# Altium project SOM Board with RK3399.PrjPcb
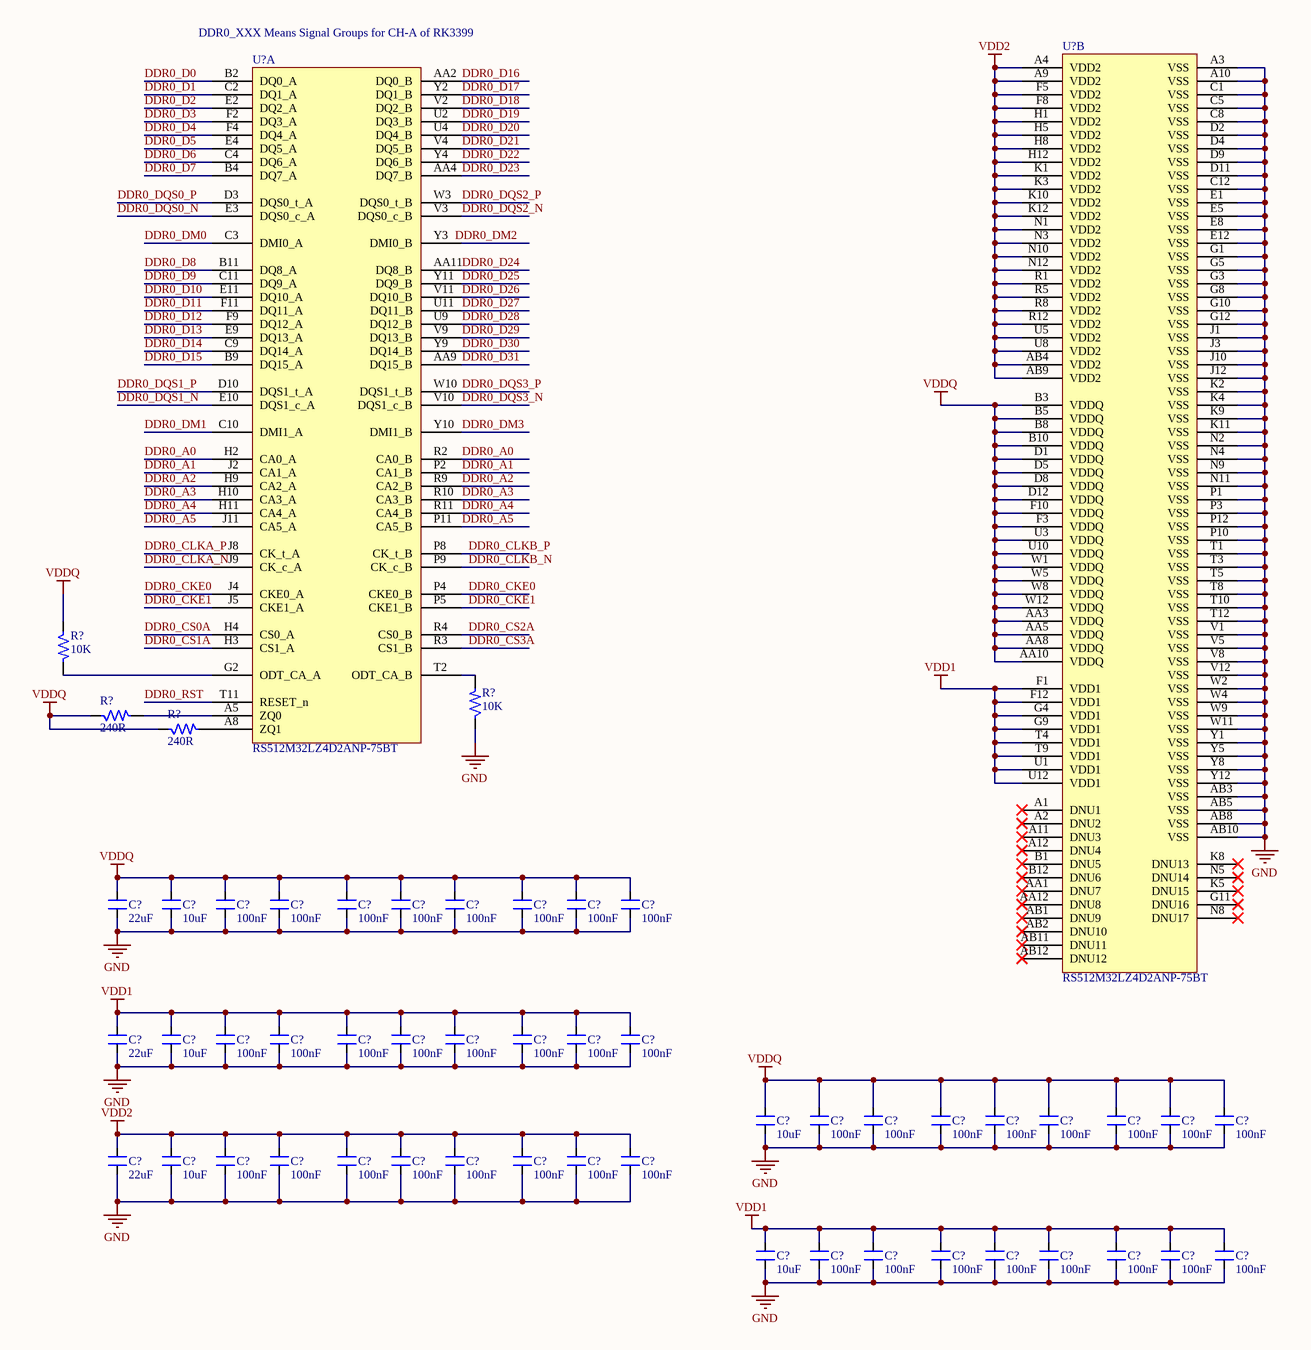
[diagram p0: Sheet1.SchDoc]
3 sheets, 122 parts. Net scope: global (net labels, ports and power ports of the same name join across sheets).
Sheets:
  Sheet1.SchDoc
  Sheet2.SchDoc
  Sheet3.SchDoc

## Sheet Sheet1.SchDoc
size A3

### Parts
(Parts that share a designator on the sheet are numbered #1, #2 ... from top to bottom, then left to right.)
C?#1  22uF  [CAP_0603]
C?#2  10uF  [CAP_0603]
C?#3  100nF  [CAP_0201]
C?#4  100nF  [CAP_0201]
C?#5  100nF  [CAP_0201]
C?#6  100nF  [CAP_0201]
C?#7  100nF  [CAP_0201]
C?#8  100nF  [CAP_0201]
C?#9  100nF  [CAP_0201]
C?#10  100nF  [CAP_0201]
C?#11  22uF  [CAP_0603]
C?#12  10uF  [CAP_0603]
C?#13  100nF  [CAP_0201]
C?#14  100nF  [CAP_0201]
C?#15  100nF  [CAP_0201]
C?#16  100nF  [CAP_0201]
C?#17  100nF  [CAP_0201]
C?#18  100nF  [CAP_0201]
C?#19  100nF  [CAP_0201]
C?#20  100nF  [CAP_0201]
C?#21  10uF  [CAP_0603]
C?#22  100nF  [CAP_0201]
C?#23  100nF  [CAP_0201]
C?#24  100nF  [CAP_0201]
C?#25  100nF  [CAP_0201]
C?#26  100nF  [CAP_0201]
C?#27  100nF  [CAP_0201]
C?#28  100nF  [CAP_0201]
C?#29  100nF  [CAP_0201]
C?#30  22uF  [CAP_0603]
C?#31  10uF  [CAP_0603]
C?#32  100nF  [CAP_0201]
C?#33  100nF  [CAP_0201]
C?#34  100nF  [CAP_0201]
C?#35  100nF  [CAP_0201]
C?#36  100nF  [CAP_0201]
C?#37  100nF  [CAP_0201]
C?#38  100nF  [CAP_0201]
C?#39  100nF  [CAP_0201]
C?#40  10uF  [CAP_0603]
C?#41  100nF  [CAP_0201]
C?#42  100nF  [CAP_0201]
C?#43  100nF  [CAP_0201]
C?#44  100nF  [CAP_0201]
C?#45  100nF  [CAP_0201]
C?#46  100nF  [CAP_0201]
C?#47  100nF  [CAP_0201]
C?#48  100nF  [CAP_0201]
R?#1  10K  [RES_0201]
R?#2  240R  [RES_0201]
R?#3  240R  [RES_0201]
R?#4  10K  [RES_0201]
U?#1  RS512M32LZ4D2ANP-75BT  [FBGA200_SMD]  (part B of 2)
U?#2  RS512M32LZ4D2ANP-75BT  [FBGA200_SMD]  (part A of 2)

### Nets
GND: C?#1.1 C?#2.1 C?#3.1 C?#4.1 C?#5.1 C?#6.1 C?#7.1 C?#8.1 C?#9.1 C?#10.1 C?#11.1 C?#12.1 C?#13.1 C?#14.1 C?#15.1 C?#16.1 C?#17.1 C?#18.1 C?#19.1 C?#20.1 C?#21.1 C?#22.1 C?#23.1 C?#24.1 C?#25.1 C?#26.1 C?#27.1 C?#28.1 C?#29.1 C?#30.1 C?#31.1 C?#32.1 C?#33.1 C?#34.1 C?#35.1 C?#36.1 C?#37.1 C?#38.1 C?#39.1 C?#40.1 C?#41.1 C?#42.1 C?#43.1 C?#44.1 C?#45.1 C?#46.1 C?#47.1 C?#48.1 R?#4.1 U?#1.A3(VSS) U?#1.A10(VSS) U?#1.AB3(VSS) U?#1.AB5(VSS) U?#1.AB8(VSS) U?#1.AB10(VSS) U?#1.C1(VSS) U?#1.C5(VSS) U?#1.C8(VSS) U?#1.C12(VSS) U?#1.D2(VSS) U?#1.D4(VSS) U?#1.D9(VSS) U?#1.D11(VSS) U?#1.E1(VSS) U?#1.E5(VSS) U?#1.E8(VSS) U?#1.E12(VSS) U?#1.G1(VSS) U?#1.G3(VSS) U?#1.G5(VSS) U?#1.G8(VSS) U?#1.G10(VSS) U?#1.G12(VSS) U?#1.J1(VSS) U?#1.J3(VSS) U?#1.J10(VSS) U?#1.J12(VSS) U?#1.K2(VSS) U?#1.K4(VSS) U?#1.K9(VSS) U?#1.K11(VSS) U?#1.N2(VSS) U?#1.N4(VSS) U?#1.N9(VSS) U?#1.N11(VSS) U?#1.P1(VSS) U?#1.P3(VSS) U?#1.P10(VSS) U?#1.P12(VSS) U?#1.T1(VSS) U?#1.T3(VSS) U?#1.T5(VSS) U?#1.T8(VSS) U?#1.T10(VSS) U?#1.T12(VSS) U?#1.V1(VSS) U?#1.V5(VSS) U?#1.V8(VSS) U?#1.V12(VSS) U?#1.W2(VSS) U?#1.W4(VSS) U?#1.W9(VSS) U?#1.W11(VSS) U?#1.Y1(VSS) U?#1.Y5(VSS) U?#1.Y8(VSS) U?#1.Y12(VSS)
VDD1: C?#11.2 C?#12.2 C?#13.2 C?#14.2 C?#15.2 C?#16.2 C?#17.2 C?#18.2 C?#19.2 C?#20.2 C?#40.2 C?#41.2 C?#42.2 C?#43.2 C?#44.2 C?#45.2 C?#46.2 C?#47.2 C?#48.2 U?#1.F1(VDD1) U?#1.F12(VDD1) U?#1.G4(VDD1) U?#1.G9(VDD1) U?#1.T4(VDD1) U?#1.T9(VDD1) U?#1.U1(VDD1) U?#1.U12(VDD1)
VDD2: C?#30.2 C?#31.2 C?#32.2 C?#33.2 C?#34.2 C?#35.2 C?#36.2 C?#37.2 C?#38.2 C?#39.2 U?#1.A4(VDD2) U?#1.A9(VDD2) U?#1.AB4(VDD2) U?#1.AB9(VDD2) U?#1.F5(VDD2) U?#1.F8(VDD2) U?#1.H1(VDD2) U?#1.H5(VDD2) U?#1.H8(VDD2) U?#1.H12(VDD2) U?#1.K1(VDD2) U?#1.K3(VDD2) U?#1.K10(VDD2) U?#1.K12(VDD2) U?#1.N1(VDD2) U?#1.N3(VDD2) U?#1.N10(VDD2) U?#1.N12(VDD2) U?#1.R1(VDD2) U?#1.R5(VDD2) U?#1.R8(VDD2) U?#1.R12(VDD2) U?#1.U5(VDD2) U?#1.U8(VDD2)
VDDQ: C?#1.2 C?#2.2 C?#3.2 C?#4.2 C?#5.2 C?#6.2 C?#7.2 C?#8.2 C?#9.2 C?#10.2 C?#21.2 C?#22.2 C?#23.2 C?#24.2 C?#25.2 C?#26.2 C?#27.2 C?#28.2 C?#29.2 R?#1.1 R?#2.1 R?#3.1 U?#1.AA3(VDDQ) U?#1.AA5(VDDQ) U?#1.AA8(VDDQ) U?#1.AA10(VDDQ) U?#1.B3(VDDQ) U?#1.B5(VDDQ) U?#1.B8(VDDQ) U?#1.B10(VDDQ) U?#1.D1(VDDQ) U?#1.D5(VDDQ) U?#1.D8(VDDQ) U?#1.D12(VDDQ) U?#1.F3(VDDQ) U?#1.F10(VDDQ) U?#1.U3(VDDQ) U?#1.U10(VDDQ) U?#1.W1(VDDQ) U?#1.W5(VDDQ) U?#1.W8(VDDQ) U?#1.W12(VDDQ)
DDR0_A0: U?#2.H2(CA0_A) U?#2.R2(CA0_B)
DDR0_A1: U?#2.J2(CA1_A) U?#2.P2(CA1_B)
DDR0_A2: U?#2.H9(CA2_A) U?#2.R9(CA2_B)
DDR0_A3: U?#2.H10(CA3_A) U?#2.R10(CA3_B)
DDR0_A4: U?#2.H11(CA4_A) U?#2.R11(CA4_B)
DDR0_A5: U?#2.J11(CA5_A) U?#2.P11(CA5_B)
DDR0_CKE0: U?#2.J4(CKE0_A) U?#2.P4(CKE0_B)
DDR0_CKE1: U?#2.J5(CKE1_A) U?#2.P5(CKE1_B)
DDR0_CLKA_N: U?#2.J9(CK_c_A)
DDR0_CLKA_P: U?#2.J8(CK_t_A)
DDR0_CLKB_N: U?#2.P9(CK_c_B)
DDR0_CLKB_P: U?#2.P8(CK_t_B)
DDR0_CS0A: U?#2.H4(CS0_A)
DDR0_CS1A: U?#2.H3(CS1_A)
DDR0_CS2A: U?#2.R4(CS0_B)
DDR0_CS3A: U?#2.R3(CS1_B)
DDR0_D0: U?#2.B2(DQ0_A)
DDR0_D1: U?#2.C2(DQ1_A)
DDR0_D2: U?#2.E2(DQ2_A)
DDR0_D3: U?#2.F2(DQ3_A)
DDR0_D4: U?#2.F4(DQ4_A)
DDR0_D5: U?#2.E4(DQ5_A)
DDR0_D6: U?#2.C4(DQ6_A)
DDR0_D7: U?#2.B4(DQ7_A)
DDR0_D8: U?#2.B11(DQ8_A)
DDR0_D9: U?#2.C11(DQ9_A)
DDR0_D10: U?#2.E11(DQ10_A)
DDR0_D11: U?#2.F11(DQ11_A)
DDR0_D12: U?#2.F9(DQ12_A)
DDR0_D13: U?#2.E9(DQ13_A)
DDR0_D14: U?#2.C9(DQ14_A)
DDR0_D15: U?#2.B9(DQ15_A)
DDR0_D16: U?#2.AA2(DQ0_B)
DDR0_D17: U?#2.Y2(DQ1_B)
DDR0_D18: U?#2.V2(DQ2_B)
DDR0_D19: U?#2.U2(DQ3_B)
DDR0_D20: U?#2.U4(DQ4_B)
DDR0_D21: U?#2.V4(DQ5_B)
DDR0_D22: U?#2.Y4(DQ6_B)
DDR0_D23: U?#2.AA4(DQ7_B)
DDR0_D24: U?#2.AA11(DQ8_B)
DDR0_D25: U?#2.Y11(DQ9_B)
DDR0_D26: U?#2.V11(DQ10_B)
DDR0_D27: U?#2.U11(DQ11_B)
DDR0_D28: U?#2.U9(DQ12_B)
DDR0_D29: U?#2.V9(DQ13_B)
DDR0_D30: U?#2.Y9(DQ14_B)
DDR0_D31: U?#2.AA9(DQ15_B)
DDR0_DM0: U?#2.C3(DMI0_A)
DDR0_DM1: U?#2.C10(DMI1_A)
DDR0_DM3: U?#2.Y10(DMI1_B)
DDR0_DQS0_N: U?#2.E3(DQS0_c_A)
DDR0_DQS0_P: U?#2.D3(DQS0_t_A)
DDR0_DQS1_N: U?#2.E10(DQS1_c_A)
DDR0_DQS1_P: U?#2.D10(DQS1_t_A)
DDR0_DQS2_N: U?#2.V3(DQS0_c_B)
DDR0_DQS2_P: U?#2.W3(DQS0_t_B)
DDR0_DQS3_N: U?#2.V10(DQS1_c_B)
DDR0_DQS3_P: U?#2.W10(DQS1_t_B)
DDR0_RST: U?#2.T11(RESET_n)
NetR?#1_2: R?#1.2 U?#2.G2(ODT_CA_A)
NetR?#2_2: R?#2.2 U?#2.A5(ZQ0)
NetR?#3_2: R?#3.2 U?#2.A8(ZQ1)
NetR?#4_2: R?#4.2 U?#2.T2(ODT_CA_B)

Not connected (* = marked no-connect by the designer): U?#1 A1(DNU1)* A2(DNU2)* A11(DNU3)* A12(DNU4)* AA1(DNU7)* AA12(DNU8)* AB1(DNU9)* AB2(DNU10)* AB11(DNU11)* AB12(DNU12)* B1(DNU5)* B12(DNU6)* G11(DNU16)* K5(DNU15)* K8(DNU13)* N5(DNU14)* N8(DNU17)*; U?#2 Y3(DMI0_B)

### Notes on the sheet
- (near U?#2) DDR0_XXX Means Signal Groups for CH-A of RK3399
- Labels drawn without touching a wire or pin: DDR0_DM2
- Title
- Size:
- Date:
- A3
- Number:
- Time:
- Revision:
- Sheet
- of
- File:

### Library data of the parts
C?#1 C?#11 C?#30 = CAP_22uF-10V-20%-0603: 22µF ±20% 10V Ceramic Capacitor X5R 0603 (1608 Metric) /; Manufacturer: Murata Electronics; Manufacturer Part Number: GRM188R61A226ME15D; Case/Package: 0603; Supplier-1: Digikey
C?#2 C?#12 C?#21 C?#31 C?#40 = CAP_10uF-10V-10%-0603: 10µF ±10% 10V Ceramic Capacitor X5R 0603 (1608 Metric) /; Manufacturer Part Number: GRM188R61A106KE69J; Manufacturer: Murata Electronics; Case/Package: 0603; Supplier-1: Digikey
C?#3-C?#10 C?#13-C?#20 C?#22-C?#29 C?#32-C?#39 C?#41-C?#48 = CAP_100nF-25V-10%-0201: 0.1µF ±10% 25V Ceramic Capacitor X5R 0201 (0603 Metric) /; Manufacturer: TDK Corporation; Manufacturer Part Number: C0603X5R1E104K030BB; Case/Package: 0201; Supplier-1: Digikey
R?#1 R?#4 = RES_10K-0.05W-1%-0201: 10 kOhms ±1% 0.05W, 1/20W Chip Resistor 0201 (0603 Metric) Thick Film /; Manufacturer: Stackpole Electronics Inc; Manufacturer Part Number: RMCF0201FT10K0; Case/Package: 0201; Supplier-1: Digikey
R?#2 R?#3 = RES_240R-0.05W-1%-0201: 240 Ohms ±1% 0.05W, 1/20W Chip Resistor 0201 (0603 Metric) Thick Film /; Manufacturer: Yageo; Manufacturer Part Number: RC0201FR-07240RL; Case/Package: 0201; Supplier-1: Digikey
U?#1 U?#2 = IC_RS512M32LZ4D2ANP-75BT: LPDDR4/4X Package FBGA 200b Density 4Gbit~64Gbit Operating Temperature Range：-25~85℃ Speed：2667Mbps/3200Mbps/3733Mbps Voltage：VDD1/VDD2/VDDQ= 1.8 / 1.1 / 1.1 V（LPDDR4）VDD1/VDD2/VDDQ = 1.8 / 1.1 / 0.6 V（LPDDR4X）Approved Verification Platform：MTK、Spreadtrum; Manufacturer: RAYSON; Manufacturer Part Number: RS512M32LZ4D2ANP-75BT; Case/Package: FBGA 200b; Supplier-1: RAYSON

## Sheet Sheet2.SchDoc
size A3; Organization: Altium Limited; Address1: L3, 12a Rodborough Rd; Address2: Frenchs Forest; Address3: NSW; Address4: Australia 2086
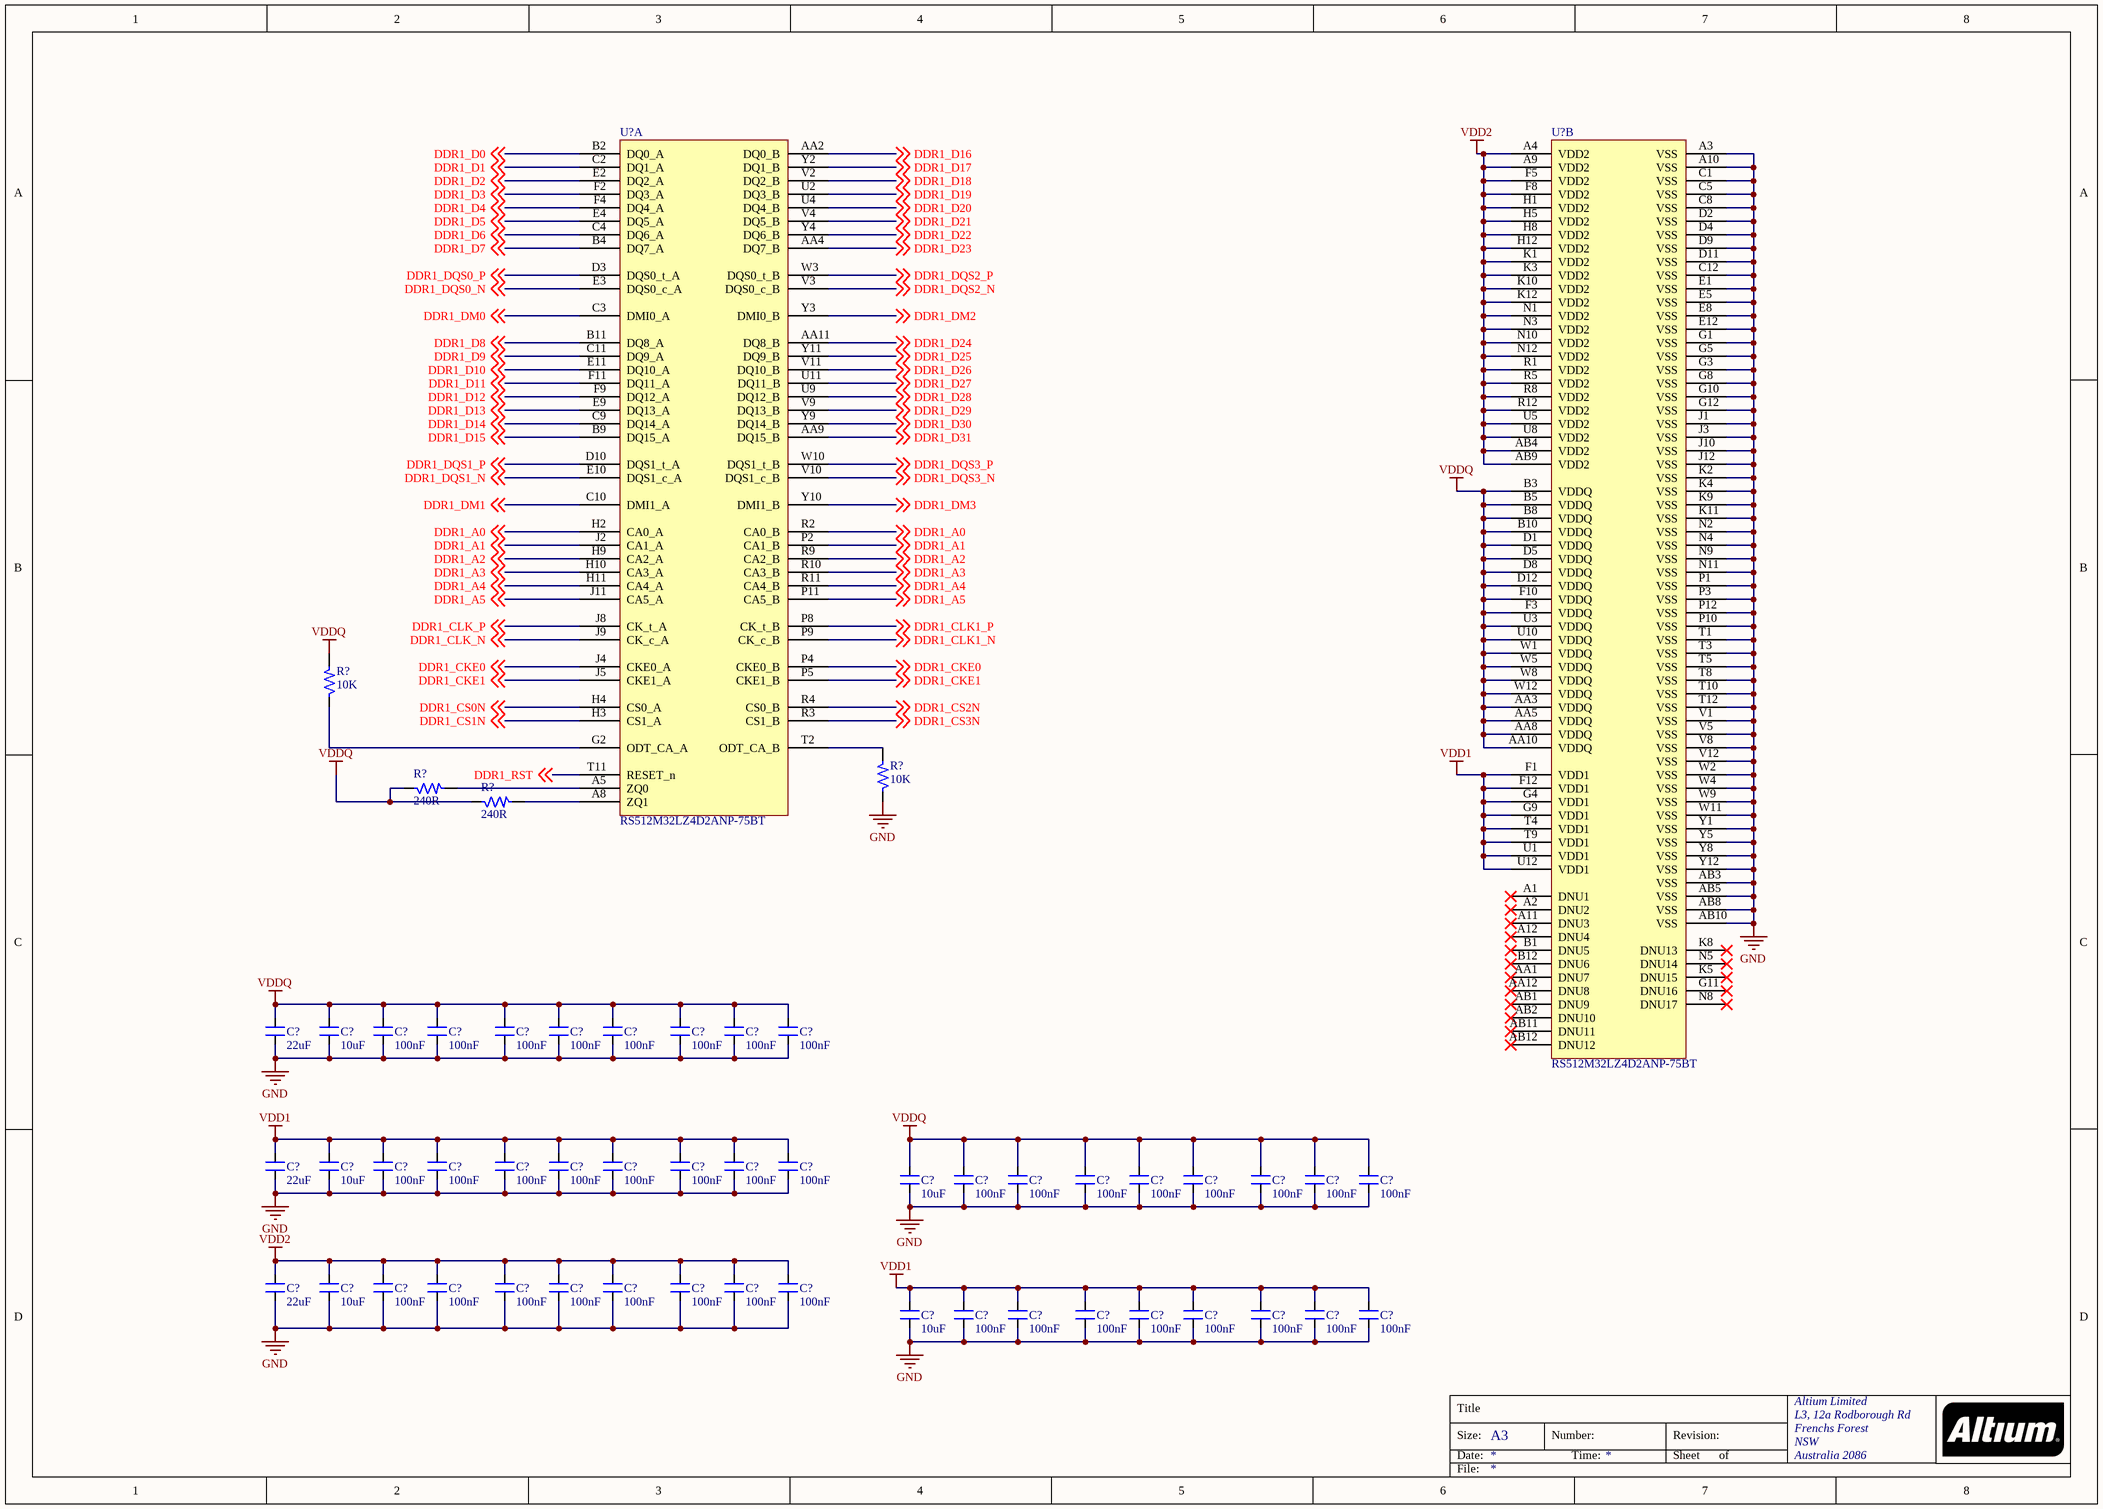
[diagram p1: Sheet2.SchDoc]

### Parts
(Parts that share a designator on the sheet are numbered #1, #2 ... from top to bottom, then left to right.)
C?#49  22uF  [CAP_0603]
C?#50  10uF  [CAP_0603]
C?#51  100nF  [CAP_0201]
C?#52  100nF  [CAP_0201]
C?#53  100nF  [CAP_0201]
C?#54  100nF  [CAP_0201]
C?#55  100nF  [CAP_0201]
C?#56  100nF  [CAP_0201]
C?#57  100nF  [CAP_0201]
C?#58  100nF  [CAP_0201]
C?#59  22uF  [CAP_0603]
C?#60  10uF  [CAP_0603]
C?#61  100nF  [CAP_0201]
C?#62  100nF  [CAP_0201]
C?#63  100nF  [CAP_0201]
C?#64  100nF  [CAP_0201]
C?#65  100nF  [CAP_0201]
C?#66  100nF  [CAP_0201]
C?#67  100nF  [CAP_0201]
C?#68  100nF  [CAP_0201]
C?#69  10uF  [CAP_0603]
C?#70  100nF  [CAP_0201]
C?#71  100nF  [CAP_0201]
C?#72  100nF  [CAP_0201]
C?#73  100nF  [CAP_0201]
C?#74  100nF  [CAP_0201]
C?#75  100nF  [CAP_0201]
C?#76  100nF  [CAP_0201]
C?#77  100nF  [CAP_0201]
C?#78  22uF  [CAP_0603]
C?#79  10uF  [CAP_0603]
C?#80  100nF  [CAP_0201]
C?#81  100nF  [CAP_0201]
C?#82  100nF  [CAP_0201]
C?#83  100nF  [CAP_0201]
C?#84  100nF  [CAP_0201]
C?#85  100nF  [CAP_0201]
C?#86  100nF  [CAP_0201]
C?#87  100nF  [CAP_0201]
C?#88  10uF  [CAP_0603]
C?#89  100nF  [CAP_0201]
C?#90  100nF  [CAP_0201]
C?#91  100nF  [CAP_0201]
C?#92  100nF  [CAP_0201]
C?#93  100nF  [CAP_0201]
C?#94  100nF  [CAP_0201]
C?#95  100nF  [CAP_0201]
C?#96  100nF  [CAP_0201]
R?#5  10K  [RES_0201]
R?#6  240R  [RES_0201]
R?#7  240R  [RES_0201]
R?#8  10K  [RES_0201]
U?#3  RS512M32LZ4D2ANP-75BT  [FBGA200_SMD]  (part A of 2)
U?#4  RS512M32LZ4D2ANP-75BT  [FBGA200_SMD]  (part B of 2)

### Nets
GND: C?#49.1 C?#50.1 C?#51.1 C?#52.1 C?#53.1 C?#54.1 C?#55.1 C?#56.1 C?#57.1 C?#58.1 C?#59.1 C?#60.1 C?#61.1 C?#62.1 C?#63.1 C?#64.1 C?#65.1 C?#66.1 C?#67.1 C?#68.1 C?#69.1 C?#70.1 C?#71.1 C?#72.1 C?#73.1 C?#74.1 C?#75.1 C?#76.1 C?#77.1 C?#78.1 C?#79.1 C?#80.1 C?#81.1 C?#82.1 C?#83.1 C?#84.1 C?#85.1 C?#86.1 C?#87.1 C?#88.1 C?#89.1 C?#90.1 C?#91.1 C?#92.1 C?#93.1 C?#94.1 C?#95.1 C?#96.1 R?#8.1 U?#4.A3(VSS) U?#4.A10(VSS) U?#4.AB3(VSS) U?#4.AB5(VSS) U?#4.AB8(VSS) U?#4.AB10(VSS) U?#4.C1(VSS) U?#4.C5(VSS) U?#4.C8(VSS) U?#4.C12(VSS) U?#4.D2(VSS) U?#4.D4(VSS) U?#4.D9(VSS) U?#4.D11(VSS) U?#4.E1(VSS) U?#4.E5(VSS) U?#4.E8(VSS) U?#4.E12(VSS) U?#4.G1(VSS) U?#4.G3(VSS) U?#4.G5(VSS) U?#4.G8(VSS) U?#4.G10(VSS) U?#4.G12(VSS) U?#4.J1(VSS) U?#4.J3(VSS) U?#4.J10(VSS) U?#4.J12(VSS) U?#4.K2(VSS) U?#4.K4(VSS) U?#4.K9(VSS) U?#4.K11(VSS) U?#4.N2(VSS) U?#4.N4(VSS) U?#4.N9(VSS) U?#4.N11(VSS) U?#4.P1(VSS) U?#4.P3(VSS) U?#4.P10(VSS) U?#4.P12(VSS) U?#4.T1(VSS) U?#4.T3(VSS) U?#4.T5(VSS) U?#4.T8(VSS) U?#4.T10(VSS) U?#4.T12(VSS) U?#4.V1(VSS) U?#4.V5(VSS) U?#4.V8(VSS) U?#4.V12(VSS) U?#4.W2(VSS) U?#4.W4(VSS) U?#4.W9(VSS) U?#4.W11(VSS) U?#4.Y1(VSS) U?#4.Y5(VSS) U?#4.Y8(VSS) U?#4.Y12(VSS)
VDD1: C?#59.2 C?#60.2 C?#61.2 C?#62.2 C?#63.2 C?#64.2 C?#65.2 C?#66.2 C?#67.2 C?#68.2 C?#88.2 C?#89.2 C?#90.2 C?#91.2 C?#92.2 C?#93.2 C?#94.2 C?#95.2 C?#96.2 U?#4.F1(VDD1) U?#4.F12(VDD1) U?#4.G4(VDD1) U?#4.G9(VDD1) U?#4.T4(VDD1) U?#4.T9(VDD1) U?#4.U1(VDD1) U?#4.U12(VDD1)
VDD2: C?#78.2 C?#79.2 C?#80.2 C?#81.2 C?#82.2 C?#83.2 C?#84.2 C?#85.2 C?#86.2 C?#87.2 U?#4.A4(VDD2) U?#4.A9(VDD2) U?#4.AB4(VDD2) U?#4.AB9(VDD2) U?#4.F5(VDD2) U?#4.F8(VDD2) U?#4.H1(VDD2) U?#4.H5(VDD2) U?#4.H8(VDD2) U?#4.H12(VDD2) U?#4.K1(VDD2) U?#4.K3(VDD2) U?#4.K10(VDD2) U?#4.K12(VDD2) U?#4.N1(VDD2) U?#4.N3(VDD2) U?#4.N10(VDD2) U?#4.N12(VDD2) U?#4.R1(VDD2) U?#4.R5(VDD2) U?#4.R8(VDD2) U?#4.R12(VDD2) U?#4.U5(VDD2) U?#4.U8(VDD2)
VDDQ: C?#49.2 C?#50.2 C?#51.2 C?#52.2 C?#53.2 C?#54.2 C?#55.2 C?#56.2 C?#57.2 C?#58.2 C?#69.2 C?#70.2 C?#71.2 C?#72.2 C?#73.2 C?#74.2 C?#75.2 C?#76.2 C?#77.2 R?#5.2 R?#6.1 R?#7.1 U?#4.AA3(VDDQ) U?#4.AA5(VDDQ) U?#4.AA8(VDDQ) U?#4.AA10(VDDQ) U?#4.B3(VDDQ) U?#4.B5(VDDQ) U?#4.B8(VDDQ) U?#4.B10(VDDQ) U?#4.D1(VDDQ) U?#4.D5(VDDQ) U?#4.D8(VDDQ) U?#4.D12(VDDQ) U?#4.F3(VDDQ) U?#4.F10(VDDQ) U?#4.U3(VDDQ) U?#4.U10(VDDQ) U?#4.W1(VDDQ) U?#4.W5(VDDQ) U?#4.W8(VDDQ) U?#4.W12(VDDQ)
DDR1_A0: U?#3.H2(CA0_A) U?#3.R2(CA0_B) ; off-sheet DDR1_A0
DDR1_A1: U?#3.J2(CA1_A) U?#3.P2(CA1_B) ; off-sheet DDR1_A1
DDR1_A2: U?#3.H9(CA2_A) U?#3.R9(CA2_B) ; off-sheet DDR1_A2
DDR1_A3: U?#3.H10(CA3_A) U?#3.R10(CA3_B) ; off-sheet DDR1_A3
DDR1_A4: U?#3.H11(CA4_A) U?#3.R11(CA4_B) ; off-sheet DDR1_A4
DDR1_A5: U?#3.J11(CA5_A) U?#3.P11(CA5_B) ; off-sheet DDR1_A5
DDR1_CKE0: U?#3.J4(CKE0_A) U?#3.P4(CKE0_B) ; off-sheet DDR1_CKE0
DDR1_CKE1: U?#3.J5(CKE1_A) U?#3.P5(CKE1_B) ; off-sheet DDR1_CKE1
DDR1_CLK1_N: U?#3.P9(CK_c_B) ; off-sheet DDR1_CLK1_N
DDR1_CLK1_P: U?#3.P8(CK_t_B) ; off-sheet DDR1_CLK1_P
DDR1_CLK_N: U?#3.J9(CK_c_A) ; off-sheet DDR1_CLK_N
DDR1_CLK_P: U?#3.J8(CK_t_A) ; off-sheet DDR1_CLK_P
DDR1_CS0N: U?#3.H4(CS0_A) ; off-sheet DDR1_CS0N
DDR1_CS1N: U?#3.H3(CS1_A) ; off-sheet DDR1_CS1N
DDR1_CS2N: U?#3.R4(CS0_B) ; off-sheet DDR1_CS2N
DDR1_CS3N: U?#3.R3(CS1_B) ; off-sheet DDR1_CS3N
DDR1_D0: U?#3.B2(DQ0_A) ; off-sheet DDR1_D0
DDR1_D1: U?#3.C2(DQ1_A) ; off-sheet DDR1_D1
DDR1_D2: U?#3.E2(DQ2_A) ; off-sheet DDR1_D2
DDR1_D3: U?#3.F2(DQ3_A) ; off-sheet DDR1_D3
DDR1_D4: U?#3.F4(DQ4_A) ; off-sheet DDR1_D4
DDR1_D5: U?#3.E4(DQ5_A) ; off-sheet DDR1_D5
DDR1_D6: U?#3.C4(DQ6_A) ; off-sheet DDR1_D6
DDR1_D7: U?#3.B4(DQ7_A) ; off-sheet DDR1_D7
DDR1_D8: U?#3.B11(DQ8_A) ; off-sheet DDR1_D8
DDR1_D9: U?#3.C11(DQ9_A) ; off-sheet DDR1_D9
DDR1_D10: U?#3.E11(DQ10_A) ; off-sheet DDR1_D10
DDR1_D11: U?#3.F11(DQ11_A) ; off-sheet DDR1_D11
DDR1_D12: U?#3.F9(DQ12_A) ; off-sheet DDR1_D12
DDR1_D13: U?#3.E9(DQ13_A) ; off-sheet DDR1_D13
DDR1_D14: U?#3.C9(DQ14_A) ; off-sheet DDR1_D14
DDR1_D15: U?#3.B9(DQ15_A) ; off-sheet DDR1_D15
DDR1_D16: U?#3.AA2(DQ0_B) ; off-sheet DDR1_D16
DDR1_D17: U?#3.Y2(DQ1_B) ; off-sheet DDR1_D17
DDR1_D18: U?#3.V2(DQ2_B) ; off-sheet DDR1_D18
DDR1_D19: U?#3.U2(DQ3_B) ; off-sheet DDR1_D19
DDR1_D20: U?#3.U4(DQ4_B) ; off-sheet DDR1_D20
DDR1_D21: U?#3.V4(DQ5_B) ; off-sheet DDR1_D21
DDR1_D22: U?#3.Y4(DQ6_B) ; off-sheet DDR1_D22
DDR1_D23: U?#3.AA4(DQ7_B) ; off-sheet DDR1_D23
DDR1_D24: U?#3.AA11(DQ8_B) ; off-sheet DDR1_D24
DDR1_D25: U?#3.Y11(DQ9_B) ; off-sheet DDR1_D25
DDR1_D26: U?#3.V11(DQ10_B) ; off-sheet DDR1_D26
DDR1_D27: U?#3.U11(DQ11_B) ; off-sheet DDR1_D27
DDR1_D28: U?#3.U9(DQ12_B) ; off-sheet DDR1_D28
DDR1_D29: U?#3.V9(DQ13_B) ; off-sheet DDR1_D29
DDR1_D30: U?#3.Y9(DQ14_B) ; off-sheet DDR1_D30
DDR1_D31: U?#3.AA9(DQ15_B) ; off-sheet DDR1_D31
DDR1_DM0: U?#3.C3(DMI0_A) ; off-sheet DDR1_DM0
DDR1_DM1: U?#3.C10(DMI1_A) ; off-sheet DDR1_DM1
DDR1_DM2: U?#3.Y3(DMI0_B) ; off-sheet DDR1_DM2
DDR1_DM3: U?#3.Y10(DMI1_B) ; off-sheet DDR1_DM3
DDR1_DQS0_N: U?#3.E3(DQS0_c_A) ; off-sheet DDR1_DQS0_N
DDR1_DQS0_P: U?#3.D3(DQS0_t_A) ; off-sheet DDR1_DQS0_P
DDR1_DQS1_N: U?#3.E10(DQS1_c_A) ; off-sheet DDR1_DQS1_N
DDR1_DQS1_P: U?#3.D10(DQS1_t_A) ; off-sheet DDR1_DQS1_P
DDR1_DQS2_N: U?#3.V3(DQS0_c_B) ; off-sheet DDR1_DQS2_N
DDR1_DQS2_P: U?#3.W3(DQS0_t_B) ; off-sheet DDR1_DQS2_P
DDR1_DQS3_N: U?#3.V10(DQS1_c_B) ; off-sheet DDR1_DQS3_N
DDR1_DQS3_P: U?#3.W10(DQS1_t_B) ; off-sheet DDR1_DQS3_P
DDR1_RST: U?#3.T11(RESET_n) ; off-sheet DDR1_RST
NetR?#5_1: R?#5.1 U?#3.G2(ODT_CA_A)
NetR?#6_2: R?#6.2 U?#3.A5(ZQ0)
NetR?#7_2: R?#7.2 U?#3.A8(ZQ1)
NetR?#8_2: R?#8.2 U?#3.T2(ODT_CA_B)

Not connected (* = marked no-connect by the designer): U?#4 A1(DNU1)* A2(DNU2)* A11(DNU3)* A12(DNU4)* AA1(DNU7)* AA12(DNU8)* AB1(DNU9)* AB2(DNU10)* AB11(DNU11)* AB12(DNU12)* B1(DNU5)* B12(DNU6)* G11(DNU16)* K5(DNU15)* K8(DNU13)* N5(DNU14)* N8(DNU17)*

### Notes on the sheet
- Title
- Size:
- Date:
- A3
- Number:
- Time:
- Revision:
- Sheet
- of
- File:

### Library data of the parts
C?#49 C?#59 C?#78 = CAP_22uF-10V-20%-0603: as C?#1 on sheet Sheet1; Case/Package: 0603; Supplier-1: Digikey
C?#50 C?#60 C?#69 C?#79 C?#88 = CAP_10uF-10V-10%-0603: as C?#2 on sheet Sheet1; Case/Package: 0603; Supplier-1: Digikey
C?#51-C?#58 C?#61-C?#68 C?#70-C?#77 C?#80-C?#87 C?#89-C?#96 = CAP_100nF-25V-10%-0201: as C?#3 on sheet Sheet1; Case/Package: 0201; Supplier-1: Digikey
R?#5 R?#8 = RES_10K-0.05W-1%-0201: as R?#1 on sheet Sheet1; Case/Package: 0201; Supplier-1: Digikey
R?#6 R?#7 = RES_240R-0.05W-1%-0201: as R?#2 on sheet Sheet1; Case/Package: 0201; Supplier-1: Digikey
U?#3 U?#4 = IC_RS512M32LZ4D2ANP-75BT: as U?#1 on sheet Sheet1; Manufacturer Part Number: RS512M32LZ4D2ANP-75BT; Case/Package: FBGA 200b; Supplier-1: RAYSON

## Sheet Sheet3.SchDoc
size A3; Organization: Altium Limited; Address1: L3, 12a Rodborough Rd; Address2: Frenchs Forest; Address3: NSW; Address4: Australia 2086
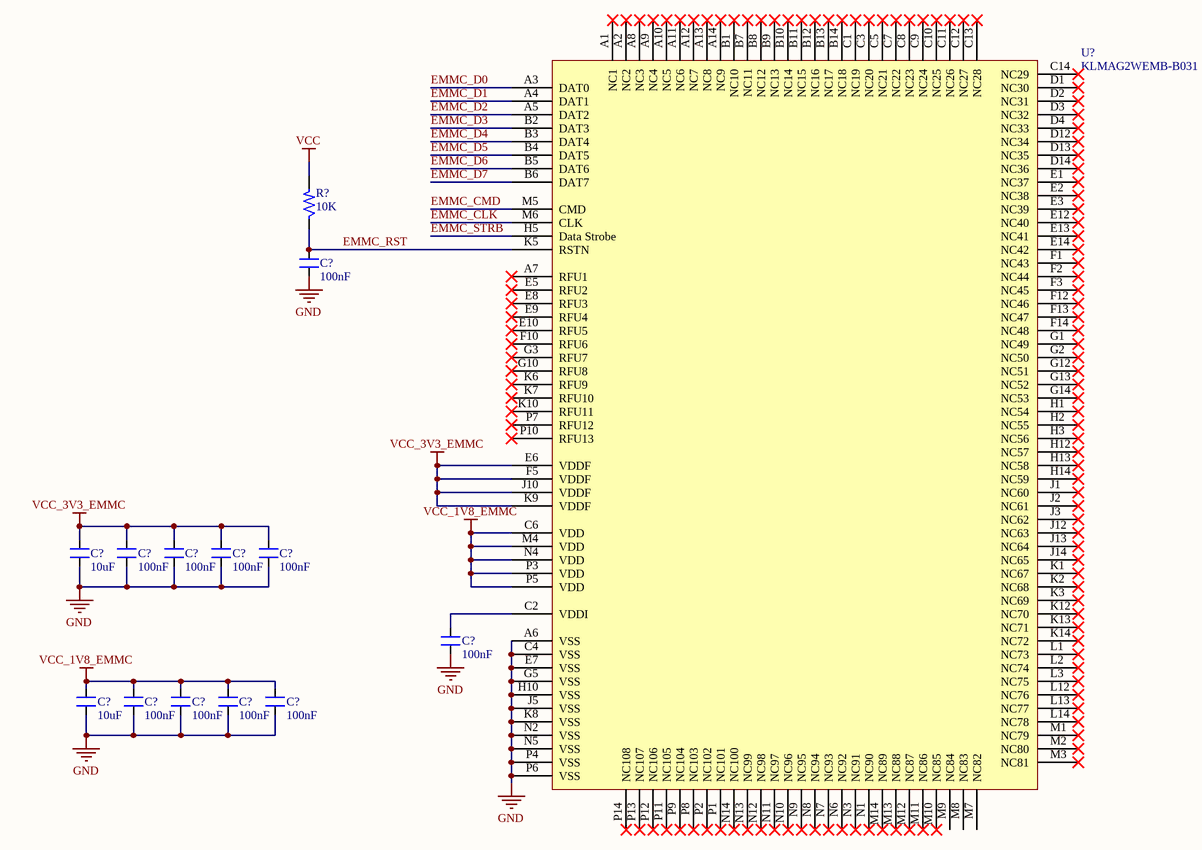
[diagram p2: Sheet3.SchDoc]

### Parts
(Parts that share a designator on the sheet are numbered #1, #2 ... from top to bottom, then left to right.)
C?#97  100nF  [CAP_0201]
C?#98  10uF  [CAP_0603]
C?#99  100nF  [CAP_0201]
C?#100  100nF  [CAP_0201]
C?#101  100nF  [CAP_0201]
C?#102  100nF  [CAP_0201]
C?#103  100nF  [CAP_0201]
C?#104  10uF  [CAP_0603]
C?#105  100nF  [CAP_0201]
C?#106  100nF  [CAP_0201]
C?#107  100nF  [CAP_0201]
C?#108  100nF  [CAP_0201]
R?#9  10K  [RES_0201]
U?#5  KLMAG2WEMB-B031  [BGA153C50P14X14_1150X1300X70]

### Nets
GND: C?#97.1 C?#98.1 C?#99.1 C?#100.1 C?#101.1 C?#102.1 C?#103.1 C?#104.1 C?#105.1 C?#106.1 C?#107.1 C?#108.1 U?#5.A6(VSS) U?#5.C4(VSS) U?#5.E7(VSS) U?#5.G5(VSS) U?#5.H10(VSS) U?#5.J5(VSS) U?#5.K8(VSS) U?#5.N2(VSS) U?#5.N5(VSS) U?#5.P4(VSS) U?#5.P6(VSS)
VCC: R?#9.2
VCC_1V8_EMMC: C?#104.2 C?#105.2 C?#106.2 C?#107.2 C?#108.2 U?#5.C6(VDD) U?#5.M4(VDD) U?#5.N4(VDD) U?#5.P3(VDD) U?#5.P5(VDD)
VCC_3V3_EMMC: C?#98.2 C?#99.2 C?#100.2 C?#101.2 C?#102.2 U?#5.E6(VDDF) U?#5.F5(VDDF) U?#5.J10(VDDF) U?#5.K9(VDDF)
EMMC_CLK: U?#5.M6(CLK)
EMMC_CMD: U?#5.M5(CMD)
EMMC_D0: U?#5.A3(DAT0)
EMMC_D1: U?#5.A4(DAT1)
EMMC_D2: U?#5.A5(DAT2)
EMMC_D3: U?#5.B2(DAT3)
EMMC_D4: U?#5.B3(DAT4)
EMMC_D5: U?#5.B4(DAT5)
EMMC_D6: U?#5.B5(DAT6)
EMMC_D7: U?#5.B6(DAT7)
EMMC_RST: C?#97.2 R?#9.1 U?#5.K5(RSTN)
EMMC_STRB: U?#5.H5(Data_Strobe)
NetC?#103_2: C?#103.2 U?#5.C2(VDDI)

Not connected (* = marked no-connect by the designer): U?#5 A1(NC1)* A2(NC2)* A7(RFU1)* A8(NC3)* A9(NC4)* A10(NC5)* A11(NC6)* A12(NC7)* A13(NC8)* A14(NC9)* B1(NC10)* B7(NC11)* B8(NC12)* B9(NC13)* B10(NC14)* B11(NC15)* B12(NC16)* B13(NC17)* B14(NC18)* C1(NC19)* C3(NC20)* C5(NC21)* C7(NC22)* C8(NC23)* C9(NC24)* C10(NC25)* C11(NC26)* C12(NC27)* C13(NC28)* C14(NC29)* D1(NC30)* D2(NC31)* D3(NC32)* D4(NC33)* D12(NC34)* D13(NC35)* D14(NC36)* E1(NC37)* E2(NC38)* E3(NC39)* E5(RFU2)* E8(RFU3)* E9(RFU4)* E10(RFU5)* E12(NC40)* E13(NC41)* E14(NC42)* F1(NC43)* F2(NC44)* F3(NC45)* F10(RFU6)* F12(NC46)* F13(NC47)* F14(NC48)* G1(NC49)* G2(NC50)* G3(RFU7)* G10(RFU8)* G12(NC51)* G13(NC52)* G14(NC53)* H1(NC54)* H2(NC55)* H3(NC56)* H12(NC57)* H13(NC58)* H14(NC59)* J1(NC60)* J2(NC61)* J3(NC62)* J12(NC63)* J13(NC64)* J14(NC65)* K1(NC67)* K2(NC68)* K3(NC69)* K6(RFU9)* K7(RFU10)* K10(RFU11)* K12(NC70)* K13(NC71)* K14(NC72)* L1(NC73)* L2(NC74)* L3(NC75)* L12(NC76)* L13(NC77)* L14(NC78)* M1(NC79)* M2(NC80)* M3(NC81)* M7(NC82) M8(NC83) M9(NC84) M10(NC85)* M11(NC86)* M12(NC87)* M13(NC88)* M14(NC89)* N1(NC90)* N3(NC91)* N6(NC92)* N7(NC93)* N8(NC94)* N9(NC95)* N10(NC96)* N11(NC97)* N12(NC98)* N13(NC99)* N14(NC100)* P1(NC101)* P2(NC102)* P7(RFU12)* P8(NC103)* P9(NC104)* P10(RFU13)* P11(NC105)* P12(NC106)* P13(NC107)* P14(NC108)*

### Notes on the sheet
- Title
- Size:
- Date:
- A3
- Number:
- Time:
- Revision:
- Sheet
- of
- File:

### Library data of the parts
C?#97 C?#99-C?#103 C?#105-C?#108 = CAP_100nF-25V-10%-0201: as C?#3 on sheet Sheet1; Case/Package: 0201; Supplier-1: Digikey
C?#98 C?#104 = CAP_10uF-10V-10%-0603: as C?#2 on sheet Sheet1; Case/Package: 0603; Supplier-1: Digikey
R?#9 = RES_10K-0.05W-1%-0201: as R?#1 on sheet Sheet1; Case/Package: 0201; Supplier-1: Digikey
U?#5 = IC_KLMAG2WEMB-B031: 16GB NAND Flash Memory; Manufacturer: Samsung Electronics; Manufacturer Part Number: KLMAG2WEMB-B031; Case/Package: 153-FBGA; Supplier-1: NA

## Nets that join several sheets
GND: Sheet1 (107 pins), Sheet2 (107 pins), Sheet3 (23 pins)
VDD1: Sheet1 (27 pins), Sheet2 (27 pins)
VDD2: Sheet1 (34 pins), Sheet2 (34 pins)
VDDQ: Sheet1 (42 pins), Sheet2 (42 pins)